# EAGLE design ESPSensorBoard (EAGLE 6.4)
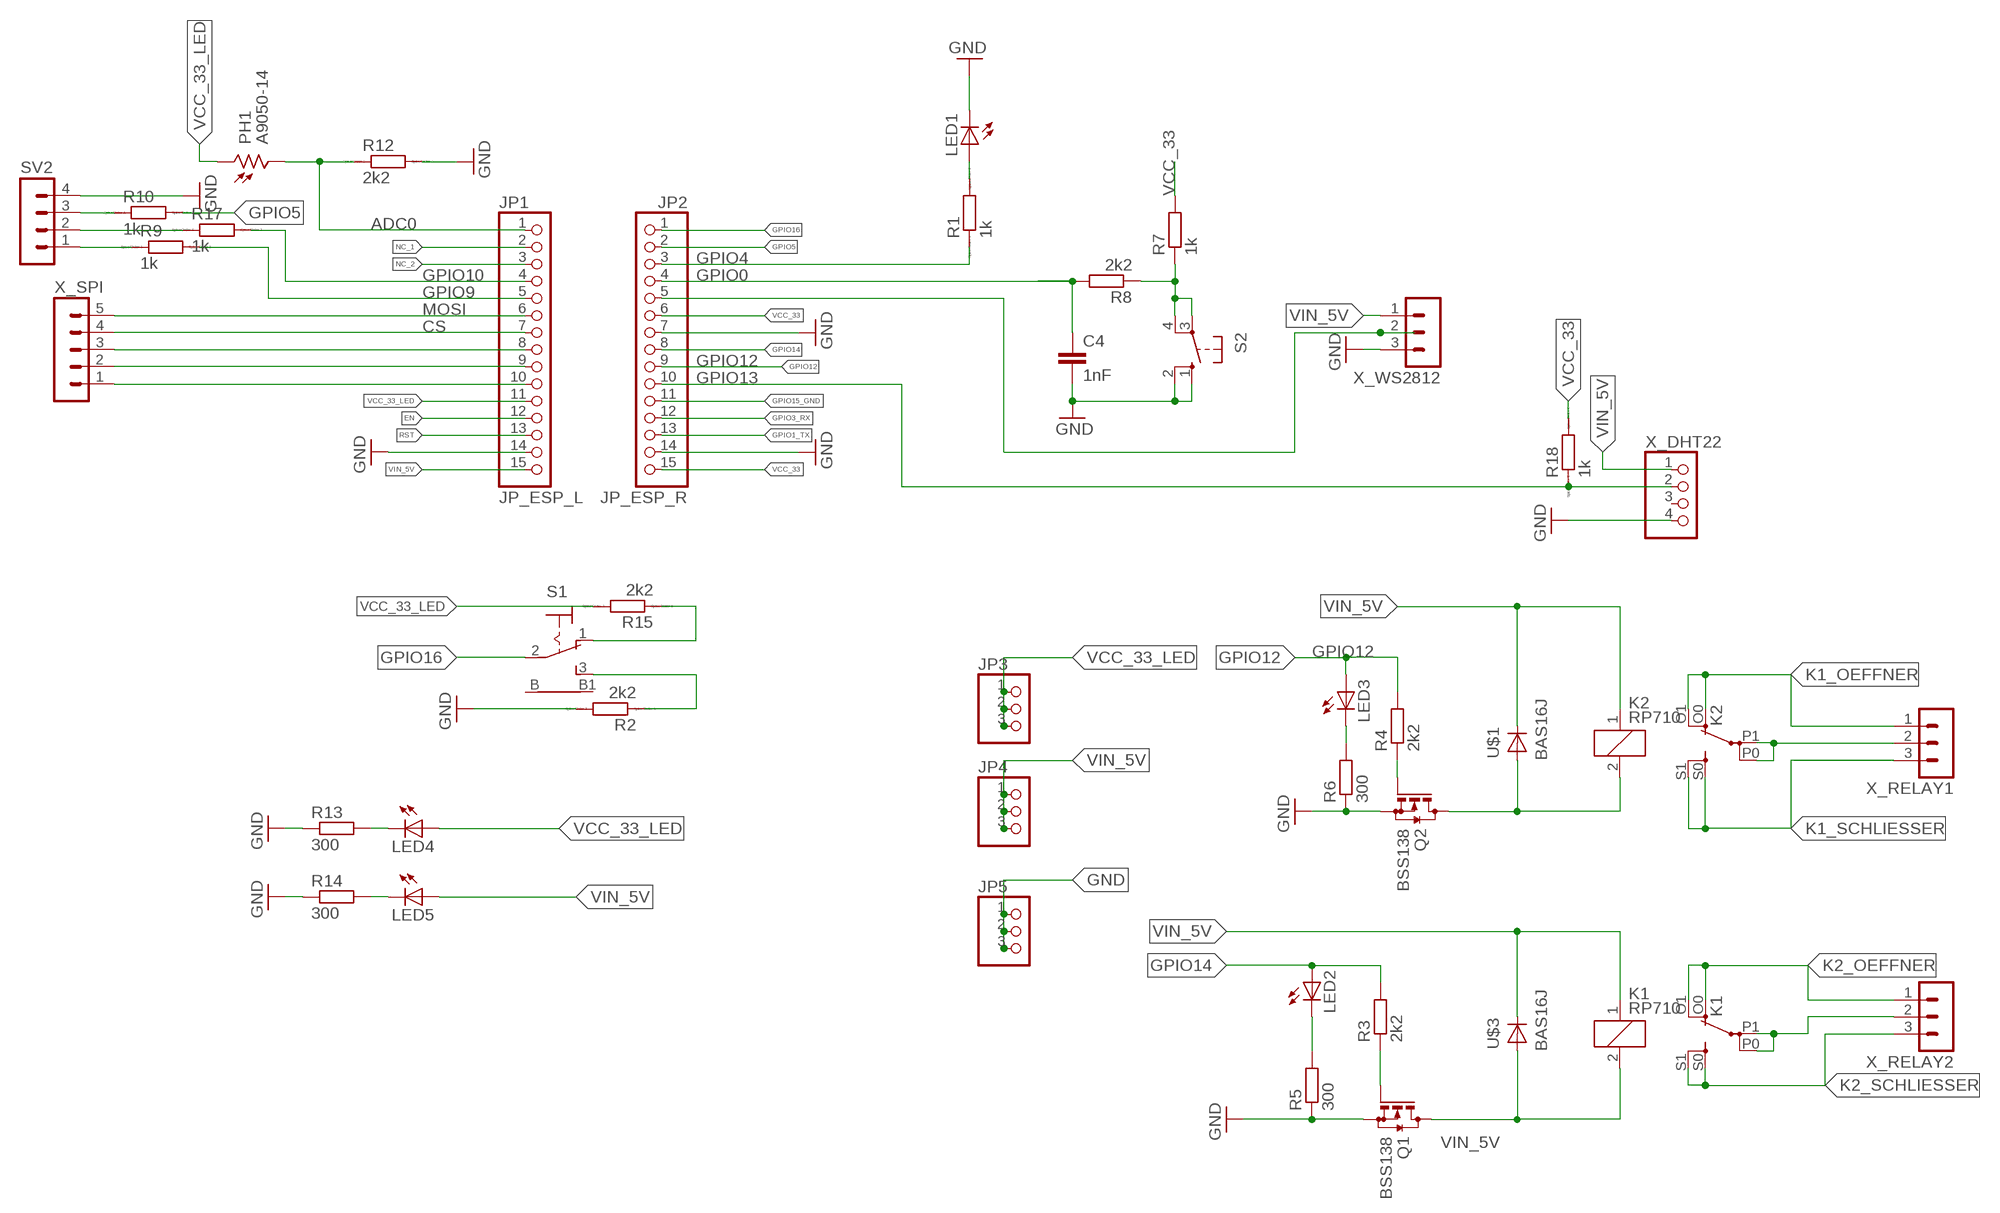
[diagram p0: schematic, sheet 1]

## Parts
C4  1nF  C-EUC0805K  [C0805K]
JP1  JP_ESP_L  PINHD-1X15  [1X15]
JP2  JP_ESP_R  PINHD-1X15  [1X15]
JP3  PINHD-1X3  [1X03]
JP4  PINHD-1X3  [1X03]
JP5  PINHD-1X3  [1X03]
K1  RP710  [RP710]
K2  RP710  [RP710]
LED1  LED5MM  [LED5MM]
LED2  LED3MM  [LED3MM]
LED3  LED3MM  [LED3MM]
LED4  LED3MM  [LED3MM]
LED5  LED3MM  [LED3MM]
PH1  A9050-14  M9960_11A  [M9960]
Q1  BSS138  BSS123  [SOT23]
Q2  BSS138  BSS123  [SOT23]
R1  1k  R  [R0805]
R2  2k2  R  [R0805]
R3  2k2  R-EU_R0805  [R0805]
R4  2k2  R-EU_R0805  [R0805]
R5  300  R-EU_R0805  [R0805]
R6  300  R-EU_R0805  [R0805]
R7  1k  R-EU_R0805  [R0805]
R8  2k2  R-EU_R0805  [R0805]
R9  1k  R  [R0805]
R10  1k  R  [R0805]
R12  2k2  R  [R0805]
R13  300  R-EU_R0805  [R0805]
R14  300  R-EU_R0805  [R0805]
R15  2k2  R  [R0805]
R17  1k  R  [R0805]
R18  1k  R  [R0805]
S1  LPV-1  [LPV-1]
S2  10-XX  [B3F-10XX]
SV2  MA04-1  [MA04-1]
U$1  BAS16J  [0805-POL]
U$3  BAS16J  [0805-POL]
X_DHT22  PINHD-1X4  [1X04]
X_RELAY1  MA03-1  [MA03-1]
X_RELAY2  MA03-1  [MA03-1]
X_SPI  MA05-1  [MA05-1]
X_WS2812  MA03-1  [MA03-1]

## Nets
ADC0: JP1.1 PH1.2 R12.1
CS: JP1.7 X_SPI.4
EN: JP1.12
GND: C4.2 JP1.14 JP2.7 JP2.14 JP5.1 JP5.2 JP5.3 LED1.K(C) Q1.2(S) Q2.2(S) R2.2 R5.1 R6.1 R12.2 R13.1 R14.1 S2.1(S) S2.2(S1) SV2.4 X_DHT22.4 X_WS2812.3
GPIO0: C4.1 JP2.4 R8.2
GPIO1_TX: JP2.13
GPIO2: JP2.5 X_WS2812.2
GPIO3_RX: JP2.12
GPIO4: JP2.3 R1.1
GPIO5: JP2.2 R10.2
GPIO9: JP1.5 R9.2
GPIO10: JP1.4 R17.2
GPIO12: JP2.9 LED3.A R4.2
GPIO13: JP2.10 R18.1 X_DHT22.2
GPIO14: JP2.8 LED2.A R3.2
GPIO15_GND: JP2.11
GPIO16: JP2.1 S1.2(P)
K1_OEFFNER: K2.O0(2:O) K2.O1(2:O) X_RELAY1.1
K1_SCHLIESSER: K2.S0(2:S) K2.S1(2:S) X_RELAY1.3
K2_OEFFNER: K1.O0(2:O) K1.O1(2:O) X_RELAY2.1
K2_SCHLIESSER: K1.S0(2:S) K1.S1(2:S) X_RELAY2.3
MOSI: JP1.6 X_SPI.5
N$1: R2.1 S1.3(S)
N$2: Q2.1(G) R4.1
N$3: LED1.A R1.2
N$4: Q1.1(G) R3.1
N$5: R9.1 SV2.1
N$6: R10.1 SV2.3
N$7: K1.P0(2:P) K1.P1(2:P) X_RELAY2.2
N$8: K1.2 Q1.3(D) U$3.A
N$9: LED4.K(C) R13.2
N$10: JP1.8 X_SPI.3
N$11: K2.P0(2:P) K2.P1(2:P) X_RELAY1.2
N$12: K2.2 Q2.3(D) U$1.A
N$13: LED2.K(C) R5.2
N$14: LED3.K(C) R6.2
N$15: R7.1 R8.1 S2.3(P) S2.4(P1)
N$16: LED5.K(C) R14.2
N$17: JP1.9 X_SPI.2
N$18: JP1.10 X_SPI.1
N$19: R17.1 SV2.2
N$20: R15.1 S1.1(O)
NC_1: JP1.2
NC_2: JP1.3
RST: JP1.13
VCC_33: JP2.6 JP2.15 R7.2 R18.2
VCC_33_LED: JP1.11 JP3.1 JP3.2 JP3.3 LED4.A PH1.1 R15.2
VIN_5V: JP1.15 JP4.1 JP4.2 JP4.3 K1.1 K2.1 LED5.A U$1.K(C) U$3.K(C) X_DHT22.1 X_WS2812.1
Unconnected: S1.B S1.B1 X_DHT22.3

## Library data of the parts
C4 = rcl:C-EU: CAPACITOR, European symbol
JP1 JP2 = pinhead:PINHD-1X15: PIN HEADER
JP3-JP5 = pinhead:PINHD-1X3: PIN HEADER
K1 K2 = relay:RP710: RELAY 2 x switch, Schrack; MF: TYCO ELECTRONICS; MPN: RP710024; OC_FARNELL: 388312; OC_NEWARK: 17M1785
LED1-LED5 = led:LED: LED OSRAM: - CHIPLED LG R971, LG N971, LY N971, LG Q971, LY Q971, LO R971, LY R971 LH N974, LH R974 LS Q976, LO Q976, LY Q976 LO Q996 - Hyper CHIPLED LW Q18S LB Q993, LB Q99A, LB R99A - SideLED LS A670, LO A670, LY A670, LG A670, LP A670 LB A673, LV A673, LT A673, LW A673 LH A674 LY A675 LS A676, LA A676, LO A676, LY A676, LW A676 LS A679, LY A679, LG A679 - Hyper Micro SIDELED® LS Y876, LA Y876, LO Y876, LY Y876 LT Y87S - SmartLED LW L88C, LW L88S LB L89C, LB L89S, LG L890 LS L89K, LO L89K, LY L89K LS L896, LA L896, LO L896, LY L896 - TOPLED LS T670, LO T670, LY T670, LG T670, LP T670 LSG T670, LSP T670, LSY T670, LOP T670, LYG T670 LG T671, LOG T671, LSG T671 LB T673, LV T673, LT T673, LW T673 LH T674 LS T676, LA T676, LO T676, LY T676, LB T676, LH T676, LSB T676, LW T676 LB T67C, LV T67C, LT T67C, LS T67K, LO T67K, LY T67K, LW E67C LS E67B, LA E67B, LO E67B, LY E67B, LB E67C, LV E67C, LT E67C LW T67C LS T679, LY T679, LG T679 LS T770, LO T770, LY T770, LG T770, LP T770 LB T773, LV T773, LT T773, LW T773 LH T774 LS E675, LA E675, LY E675, LS T675 LS T776, LA T776, LO T776, LY T776, LB T776 LHGB T686 LT T68C, LB T68C - Hyper Mini TOPLED® LB M676 - Mini TOPLED Santana® LG M470 LS M47K, LO M47K, LY M47K Source: http://www.osram.convergy.de LUXEON: - LUMILED® LXK2-PW12-R00, LXK2-PW12-S00, LXK2-PW14-U00, LXK2-PW14-V00 LXK2-PM12-R00, LXK2-PM12-S00, LXK2-PM14-U00 LXK2-PE12-Q00, LXK2-PE12-R00, LXK2-PE12-S00, LXK2-PE14-T00, LXK2-PE14-U00 LXK2-PB12-K00, LXK2-PB12-L00, LXK2-PB12-M00, LXK2-PB14-N00, LXK2-PB14-P00, LXK2-PB14-Q00 LXK2-PR12-L00, LXK2-PR12-M00, LXK2-PR14-Q00, LXK2-PR14-R00 LXK2-PD12-Q00, LXK2-PD12-R00, LXK2-PD12-S00 LXK2-PH12-R00, LXK2-PH12-S00 LXK2-PL12-P00, LXK2-PL12-Q00, LXK2-PL12-R00 Source: www.luxeon.com KINGBRIGHT: KA-3528ASYC Source: www.kingbright.com
PH1 = photo-elements:M9960_11: Photo Sensor Beacon Light, Photometer Applications Source: http://optoelectronics.perkinelmer.com/content/Datasheets/DTS_M9960.pdf
Q1 Q2 = transistor-small-signal:BSS123: N-CHANNEL MOS FET
R1 R2 R9 R10 R12 R15 R17 R18 = eagle-ltspice:R: RESISTOR, European symbol; SPICEMODEL: NONE; SPICEPREFIX: R
R3-R8 R13 R14 = rcl:R-EU_: RESISTOR, European symbol
S1 = switchmodified:LPV-1: TOGGLE SWITCH
S2 = switch-omron:10-XX: OMRON SWITCH; MPN: B3F-1000; OC_FARNELL: 176432; OC_NEWARK: 36M3542
SV2 = con-lstb:MA04-1: PIN HEADER; OC_FARNELL: unknown; OC_NEWARK: unknown
U$1 U$3 = thomas2012:BAS16J
X_DHT22 = pinhead:PINHD-1X4: PIN HEADER
X_RELAY1 X_RELAY2 X_WS2812 = con-lstb:MA03-1: PIN HEADER; OC_FARNELL: unknown; OC_NEWARK: unknown
X_SPI = con-lstb:MA05-1: PIN HEADER; OC_FARNELL: unknown; OC_NEWARK: unknown

## Board
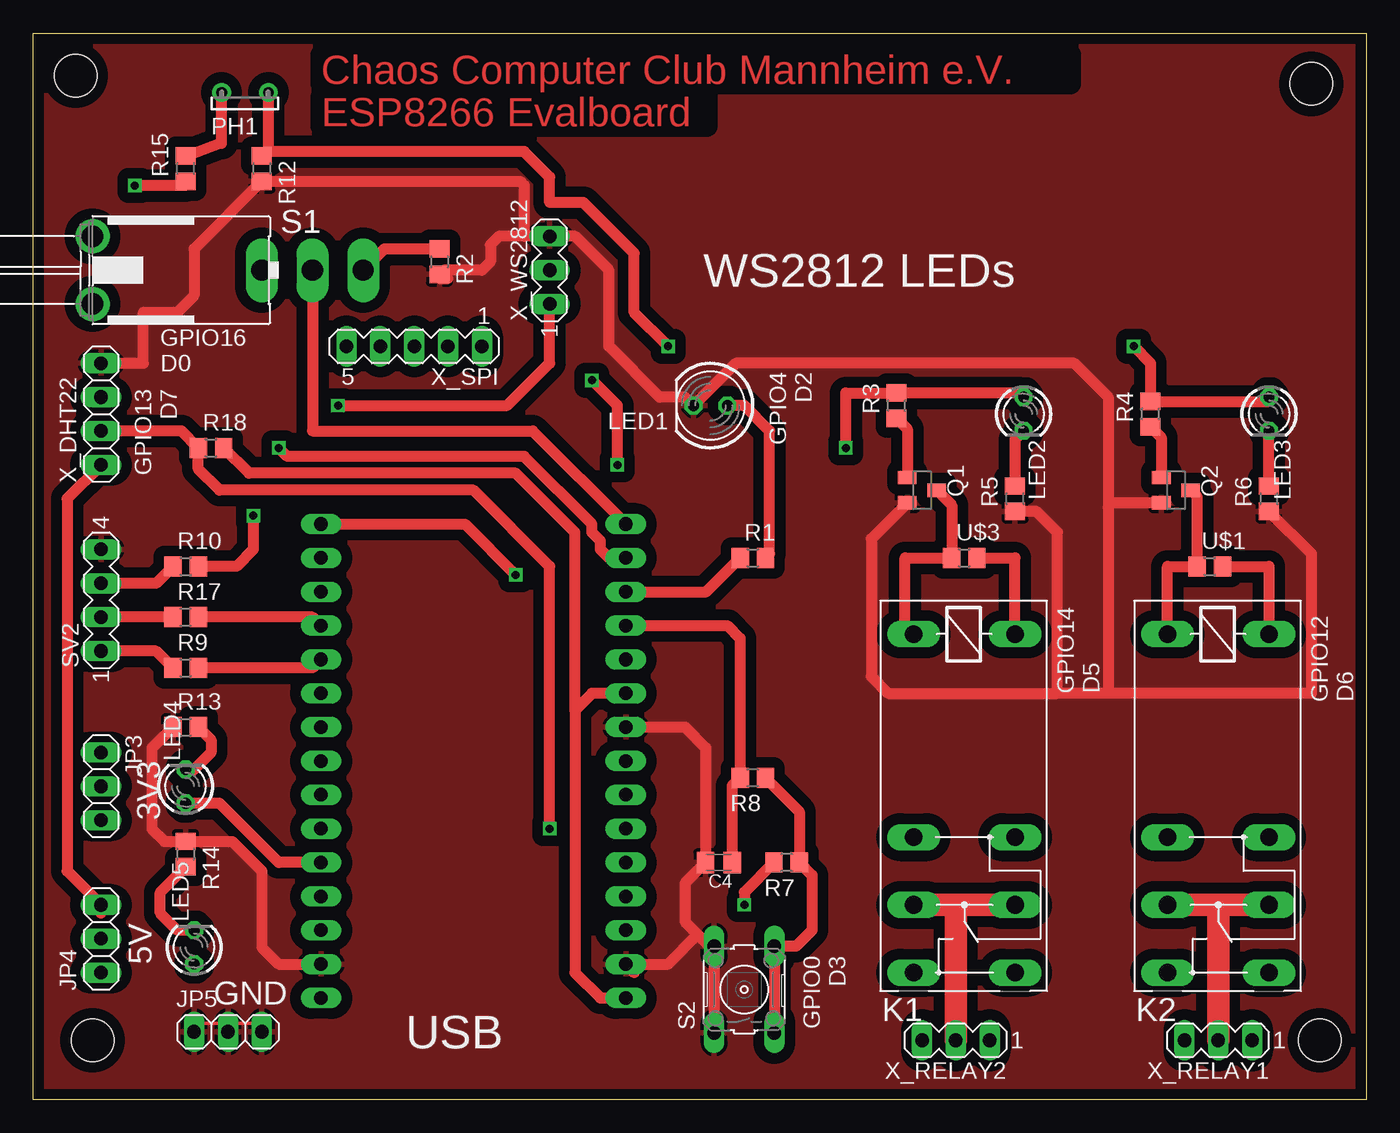
[diagram p1: board, top side]
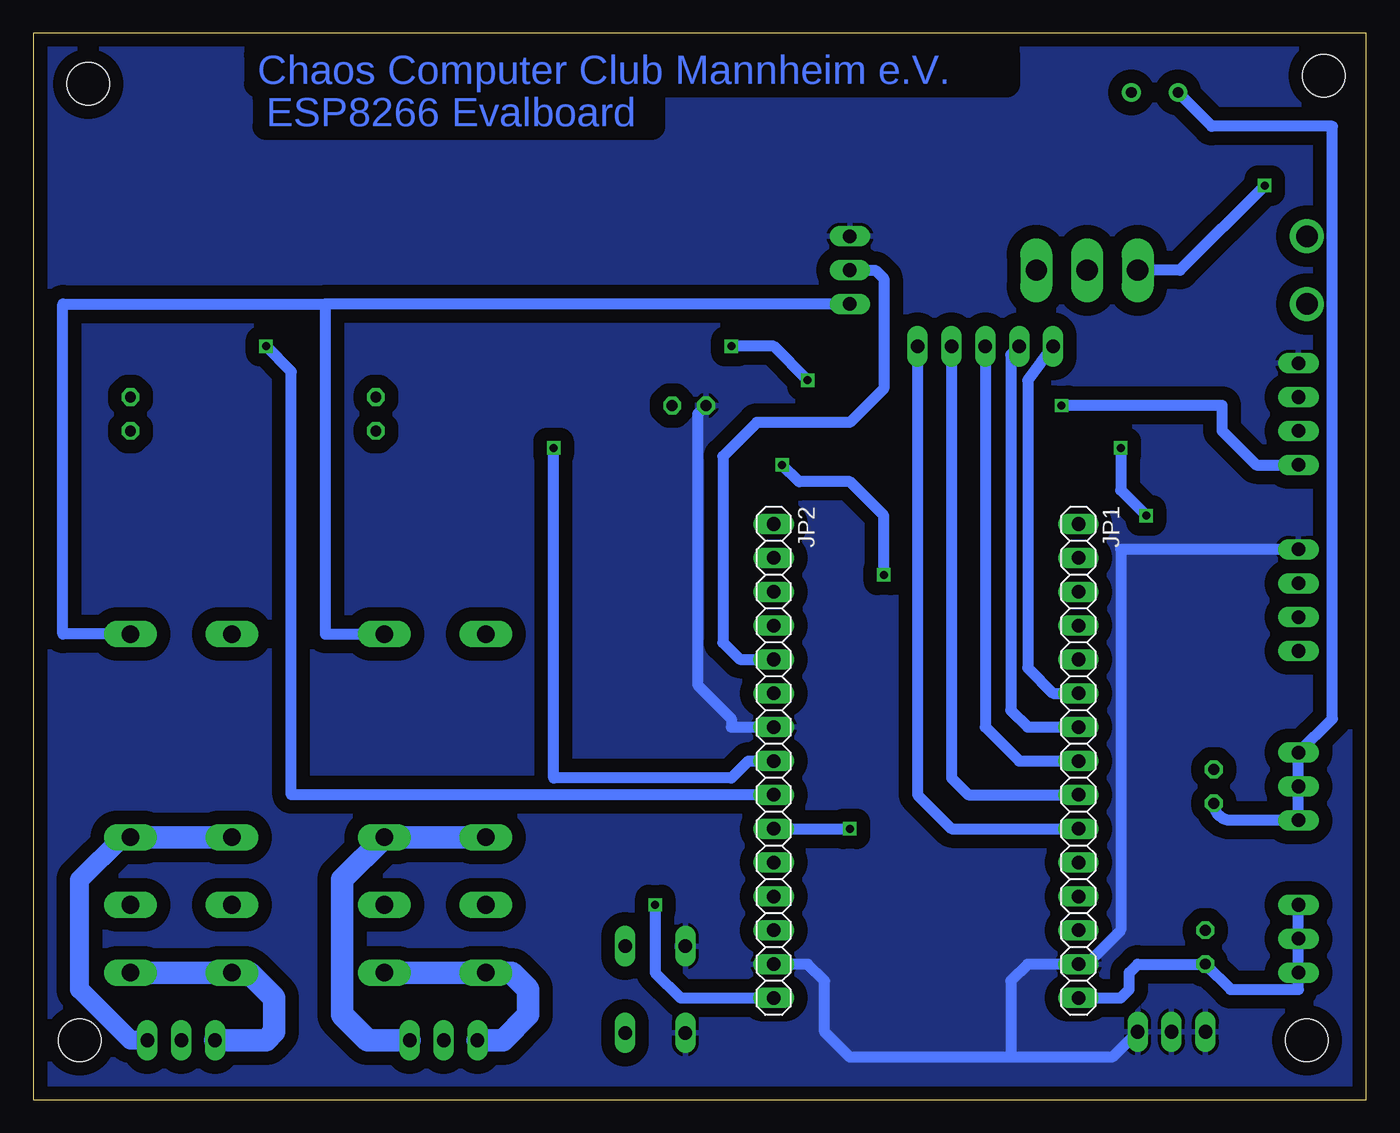
[diagram p2: board, bottom side, seen from below]

Size 100 x 80 mm. Coordinates in mm from the lower left corner, seen from the top.
Outline: 100,0 0,0 0,80 100,80 100,0
Copper layers (1*16): Top 0.035mm / dielectric 1.5mm / Bottom 0.035mm
Design rules "default *": minimum track width 6mil, minimum drill 0.2mm, track to track 6mil, track to pad 6mil, pad to pad 6mil, via to via 6mil, smd to smd 8mil, copper to edge 15mil, drill to drill 12mil, minimum pad ring 10mil, minimum via ring 8mil, stop-mask expansion 4mil, vias tented up to drill 0mil, thermal gap 10mil
Holes 3.2 mm at 4.45,4.45 96.52,4.45 95.89,76.2 3.17,76.83

### Footprints (pad centres in the part's own frame; a part is rotated, then mirrored left to right if it is on the bottom)
C0805K = smd 1.3 x 1.6: 1 -1,0; 2 1,0
1X15 = drill 1.016 long: 1 -17.78,0; 2 -15.24,0; 3 -12.7,0; 4 -10.16,0; 5 -7.62,0; 6 -5.08,0; 7 -2.54,0; 8 0,0; 9 2.54,0; 10 5.08,0; 11 7.62,0; 12 10.16,0; 13 12.7,0; 14 15.24,0; 15 17.78,0
1X03 = drill 1.016 long: 1 -2.54,0; 2 0,0; 3 2.54,0
RP710 = drill 1.321 long: 1 -3.81,3.81; 2 -3.81,-3.81; O0 11.43,3.81; O1 11.43,-3.81; P0 16.51,3.81; P1 16.51,-3.81; S0 21.59,3.81; S1 21.59,-3.81
LED5MM = drill 0.813 octagon: A -1.27,0; K 1.27,0
LED3MM = drill 0.813 octagon: A -1.27,0; K 1.27,0
M9960 = drill 0.8 pad 1.4: 1 -1.75,0; 2 1.75,0
SOT23 = smd 1 x 1.4: 1 -0.95,-1.1; 2 0.95,-1.1; 3 0,1.1
R0805 = smd 1.3 x 1.5: 1 -0.95,0; 2 0.95,0
LPV-1 = drill 1.6 long: 1 0,12.7; 2 0,16.5; 3 0,20.3 | drill 1.6 pad 2.54: B -2.54,0; B1 2.54,0
B3F-10XX = drill 1.016 long: 1 -3.251,2.261; 2 3.251,2.261; 3 -3.251,-2.261; 4 3.251,-2.261
MA04-1 = drill 1.016 long: 1 -3.81,0; 2 -1.27,0; 3 1.27,0; 4 3.81,0
0805-POL = smd 1.3 x 1.5: A -0.95,0; K 0.95,0
1X04 = drill 1.016 long: 1 -3.81,0; 2 -1.27,0; 3 1.27,0; 4 3.81,0
MA03-1 = drill 1.016 long: 1 -2.54,0; 2 0,0; 3 2.54,0
MA05-1 = drill 1.016 long: 1 -5.08,0; 2 -2.54,0; 3 0,0; 4 2.54,0; 5 5.08,0

### Placement (x,y rotation side)
C4  51.44,17.78 180 top
JP1  21.59,25.4 270 bottom
JP2  44.45,25.4 270 bottom
JP3  5.08,23.5 270 top
JP4  5.08,12.06 90 top
JP5  14.61,5.08 0 top
K1  69.85,31.11 270 top
K2  88.9,31.11 270 top
LED1  50.8,52.07 180 top
LED2  74.3,51.44 270 top
LED3  92.71,51.44 270 top
LED4  11.43,23.5 90 top
LED5  12.06,11.43 90 top
PH1  15.88,75.56 0 top
Q1  66.67,45.72 270 top
Q2  85.72,45.72 270 top
R1  53.98,40.64 0 top
R2  30.48,62.87 270 top
R3  64.77,52.07 90 top
R4  83.82,51.44 90 top
R5  73.66,45.09 90 top
R6  92.71,45.09 90 top
R7  56.52,17.78 180 top
R8  53.98,24.13 180 top
R9  11.43,32.38 0 top
R10  11.43,40.01 0 top
R12  17.14,69.85 270 top
R13  11.43,27.94 0 top
R14  11.43,18.41 270 top
R15  11.43,69.85 90 top
R17  11.43,36.2 0 top
R18  13.34,48.9 0 top
S1  4.45,62.23 270 top
S2  53.34,8.26 90 top
SV2  5.08,37.47 90 top
U$1  88.27,40.01 0 top
U$3  69.85,40.64 0 top
X_DHT22  5.08,51.44 90 top
X_RELAY1  88.9,4.45 180 top
X_RELAY2  69.22,4.45 180 top
X_SPI  28.57,56.52 180 top
X_WS2812  38.73,62.23 90 top

### Tracks (layer width: path | path; a pad name or v marks a point on that pad's centre or on a via)
ADC0  (via drill 0.6)
  Top 0.813: PH1.2 17.62,71.28 R12.1 17.46,71.12 36.83,71.12 38.73,69.22 38.73,67.31 41.27,67.31 45.09,63.5 45.09,59.05 v47.62,56.52 | JP1.1 32.38,43.18 v36.2,39.37 | v43.81,47.62 43.81,52.07 v41.91,53.98
  Bottom 0.813: v36.2,39.37 36.2,43.81 38.73,46.35 42.55,46.35 v43.81,47.62 | v41.91,53.98 44.45,56.52 v47.62,56.52
CS
  Bottom 0.813: X_SPI.4 26.67,55.88 26.67,29.21 25.4,27.94 JP1.7
GND
  Top 0.254: JP5.1 12.7,5.71 13.97,5.71 JP5.2 15.24,5.71 16.51,5.71 JP5.3
  Top 0.813: S2.1 S2.2 50.72,11.51 49.85,12.38 | 49.85,12.38 48.9,13.34 48.9,16.24 C4.2 50.44,26.4 48.9,27.94 JP2.7 | 49.85,12.38 47.62,10.16 JP2.14 45.09,9.53 | 36.83,64.77 X_WS2812.3 40.64,64.77 43.18,62.23 43.18,56.52 46.99,52.7 48.9,52.7 LED1.K 52.7,55.24 78.11,55.24 80.64,52.7 80.64,44.45 | 36.83,64.77 34.92,64.77 34.29,64.14 34.29,62.87 33.66,62.23 30.8,62.23 R2.2 30.48,61.59 31.11,61.59 | 36.83,64.77 36.83,68.58 36.51,68.9 R12.2 12.06,63.82 12.06,60.33 10.79,59.05 8.26,59.05 8.26,55.24 X_DHT22.4 | 20.32,10.16 JP1.14 18.41,10.16 17.14,11.43 17.14,17.14 14.93,19.36 R14.1 9.85,19.36 8.89,20.32 8.89,26.35 R13.1 | Q1.2 62.87,42.06 62.87,31.75 64.14,30.48 76.83,30.48 | 76.83,30.48 76.83,42.55 75.25,44.13 R5.1 | R6.1 95.89,40.96 95.89,30.48 80.64,30.48 | 80.64,30.48 76.83,30.48 | 80.64,44.45 80.64,30.48 | Q2.2 80.97,44.77 80.64,44.45
  Bottom 0.813: JP5.3 19.05,3.17 26.67,3.17 | 26.67,3.17 38.73,3.17 40.64,5.08 40.64,8.89 41.91,10.16 JP2.14 | 26.67,3.17 26.67,8.89 25.4,10.16 JP1.14 20.95,10.16 18.41,12.7 18.41,41.27 SV2.4 | LED1.K 50.16,51.44 50.16,31.11 47.62,28.57 47.62,27.94 JP2.7
  pour Bottom (isolate 1.016): 0.64,79.38 99.06,79.38 99.06,0.64 0.64,0.64
  pour Top (isolate 0.813): 0.64,79.38 0.64,0.64 99.69,0.64 99.69,79.38
GPIO0
  Top 0.813: C4.1 52.44,23.54 R8.2 53.02,34.6 52.07,35.56 JP2.4
GPIO2
  Bottom 0.813: X_WS2812.2 36.83,62.23 36.2,61.59 36.2,53.34 38.73,50.8 45.72,50.8 48.26,48.26 48.26,34.29 46.99,33.02 JP2.5
GPIO4
  Top 0.813: JP2.3 50.48,38.1 R1.1
GPIO5  (via drill 0.6)
  Top 0.813: JP2.2 43.18,40.64 42.55,41.27 42.55,41.91 41.91,42.55 41.91,43.18 36.83,48.26 19.05,48.26 v18.41,48.9 | v16.51,43.81 16.51,41.27 15.24,40.01 R10.2
  Bottom 0.813: v18.41,48.9 18.41,45.72 v16.51,43.81
GPIO9
  Top 0.813: JP1.5 20.95,32.38 R9.2
GPIO10
  Top 0.813: JP1.4 20.95,36.2 R17.2
GPIO12  (via drill 0.6)
  Top 0.813: LED3.A 92.71,52.38 R4.2 83.82,55.24 v82.55,56.52
  Bottom 0.813: JP2.9 80.64,22.86 80.64,54.61 v82.55,56.52
GPIO13  (via drill 0.6)
  Top 0.813: v38.73,20.32 38.73,40.01 33.02,45.72 13.97,45.72 12.38,47.3 R18.1 11.12,50.16 X_DHT22.2
  Bottom 0.813: JP2.10 v38.73,20.32
GPIO14  (via drill 0.6)
  Top 0.813: LED2.A 73.98,53.02 R3.2 60.96,53.02 v60.96,48.9
  Bottom 0.813: JP2.8 46.35,25.4 47.62,24.13 60.96,24.13 v60.96,48.9
GPIO16
  Top 0.813: S1.2 20.95,50.16 37.47,50.16 JP2.1
K1_OEFFNER
  Bottom 1.422: X_RELAY1.1 92.71,4.45 96.52,8.26 96.52,16.51 93.34,19.68 K2.O0
  Bottom 1.676: K2.O0 K2.O1
K1_SCHLIESSER
  Bottom 1.676: K2.S0 K2.S1 83.82,9.53 81.92,7.62 81.92,5.08 82.55,4.45 X_RELAY1.3
K2_OEFFNER
  Bottom 1.676: X_RELAY2.1 74.93,4.45 76.83,6.35 76.83,16.51 K1.O0 K1.O1
K2_SCHLIESSER
  Bottom 1.676: X_RELAY2.3 64.77,4.45 62.87,6.35 62.87,8.26 64.14,9.53 K1.S1 K1.S0
MOSI
  Bottom 0.813: X_SPI.5 25.4,53.98 25.4,32.38 23.5,30.48 JP1.6
N$1
  Top 0.813: R2.1 26.33,63.81 S1.3
N$2
  Top 0.813: R4.1 84.62,49.68 Q2.1
N$3
  Top 0.813: R1.2 55.24,40.96 55.24,50.16 53.34,52.07 LED1.A
N$4
  Top 0.813: R3.1 65.58,50.31 Q1.1
N$5
  Top 0.813: R9.1 9.21,33.66 SV2.1
N$6
  Top 0.813: R10.1 9.21,38.73 SV2.3
N$7
  Top 1.676: X_RELAY2.2 69.22,14.61 K1.P0 K1.P1
N$8
  Top 0.813: Q1.3 68.9,44.59 U$3.A 65.41,40.64 65.41,34.92 K1.2
N$9
  Top 0.813: R13.2 13.34,26.98 13.34,26.04 12.06,24.77 LED4.K
N$10
  Bottom 0.813: X_SPI.3 28.57,27.94 26.04,25.4 JP1.8
N$11
  Top 1.676: X_RELAY1.2 88.9,14.61 K2.P0 K2.P1
N$12
  Top 0.813: K2.2 85.09,40.01 U$1.A 87.31,45.23 Q2.3
N$13
  Top 0.813: LED2.K 73.66,49.53 R5.2
N$14
  Top 0.813: R6.2 LED3.K
N$15
  Top 0.813: S2.3 S2.4 57.23,11.51 58.42,12.7 58.42,16.82 R7.1 57.47,21.59 R8.1
N$16
  Top 0.813: LED5.K 10.79,12.7 9.53,13.97 9.53,15.56 R14.2
N$17
  Bottom 0.813: X_SPI.2 31.11,24.13 29.84,22.86 JP1.9
N$18
  Bottom 0.813: X_SPI.1 33.66,22.86 31.11,20.32 JP1.10 20.95,20.32
N$19
  Top 0.813: R17.1 SV2.2
N$20  (via drill 0.6)
  Top 0.813: R15.1 11.43,68.58 v7.62,68.58
  Bottom 0.813: v7.62,68.58 13.97,62.23 S1.1
VCC_33  (via drill 0.6)
  Top 0.813: R7.2 53.34,15.55 v53.34,14.61 | JP2.6 41.91,30.48 40.64,29.21 | 40.64,29.21 40.64,9.53 42.55,7.62 JP2.15 | 40.64,29.21 40.64,42.55 36.2,46.99 16.19,46.99 R18.2
  Bottom 0.813: v53.34,14.61 53.34,9.53 51.44,7.62 JP2.15
VCC_33_LED
  Top 0.813: JP1.11 18.41,17.78 13.97,22.23 LED4.A | R15.2 13.97,71.75 14.12,71.75 PH1.1
  Bottom 0.813: LED4.A arc-90 10.16,20.95 JP3.3 JP3.2 JP3.1 2.54,28.57 2.54,73.03 11.59,73.03 PH1.1
VIN_5V  (via drill 0.6)
  Top 0.813: v22.86,52.07 35.56,52.07 38.73,55.24 X_WS2812.1 | 5.08,13.97 JP4.3 2.54,17.14 2.54,45.09 X_DHT22.1 | K1.1 73.66,40.64 U$3.K | U$1.K 92.71,40.01 K2.1
  Bottom 0.813: v22.86,52.07 10.79,52.07 10.79,50.16 8.26,47.62 X_DHT22.1 | JP4.3 JP4.2 JP4.1 5.08,8.26 10.16,8.26 LED5.A 17.14,10.16 17.78,9.53 17.78,8.26 18.41,7.62 JP1.15 | X_WS2812.1 78.11,59.69 | 78.11,59.69 78.11,34.92 K1.1 | K2.1 97.79,34.92 97.79,59.69 78.11,59.69

### Text on the board
Top: Chaos Computer Club Mannheim e.V. | ESP8266 Evalboard
Bottom: Chaos Computer Club Mannheim e.V. | ESP8266 Evalboard
tPlace: WS2812 LEDs | GPIO16 / D0 | GPIO4 / D2 | GPIO13 / D7 | GPIO14 / D5 | GPIO12 / D6 | 3V3 | GPIO0 / D3 | 5V | GND | USB